# Altium schematic sheet WIZ850io_SCH_V100.SchDoc (part 1 of 3)
size A4; PageSetup: Record=PageOptions|CenterHorizontal=True|CenterVertical=True|PrintScale=0.97|XCorrection=1.00|YCorrection=1.00|PrintKind=1|BorderSize=5000000|LeftOffset=0|BottomOffset=0|Orientation=2|PaperLength=1000|PaperWidth=1000|Scale=100|PaperSource=7|PrintQuality=-3|MediaType=1|DitherType=10|PrintScaleMode=1|PaperKind=A4|PaperIndex=9
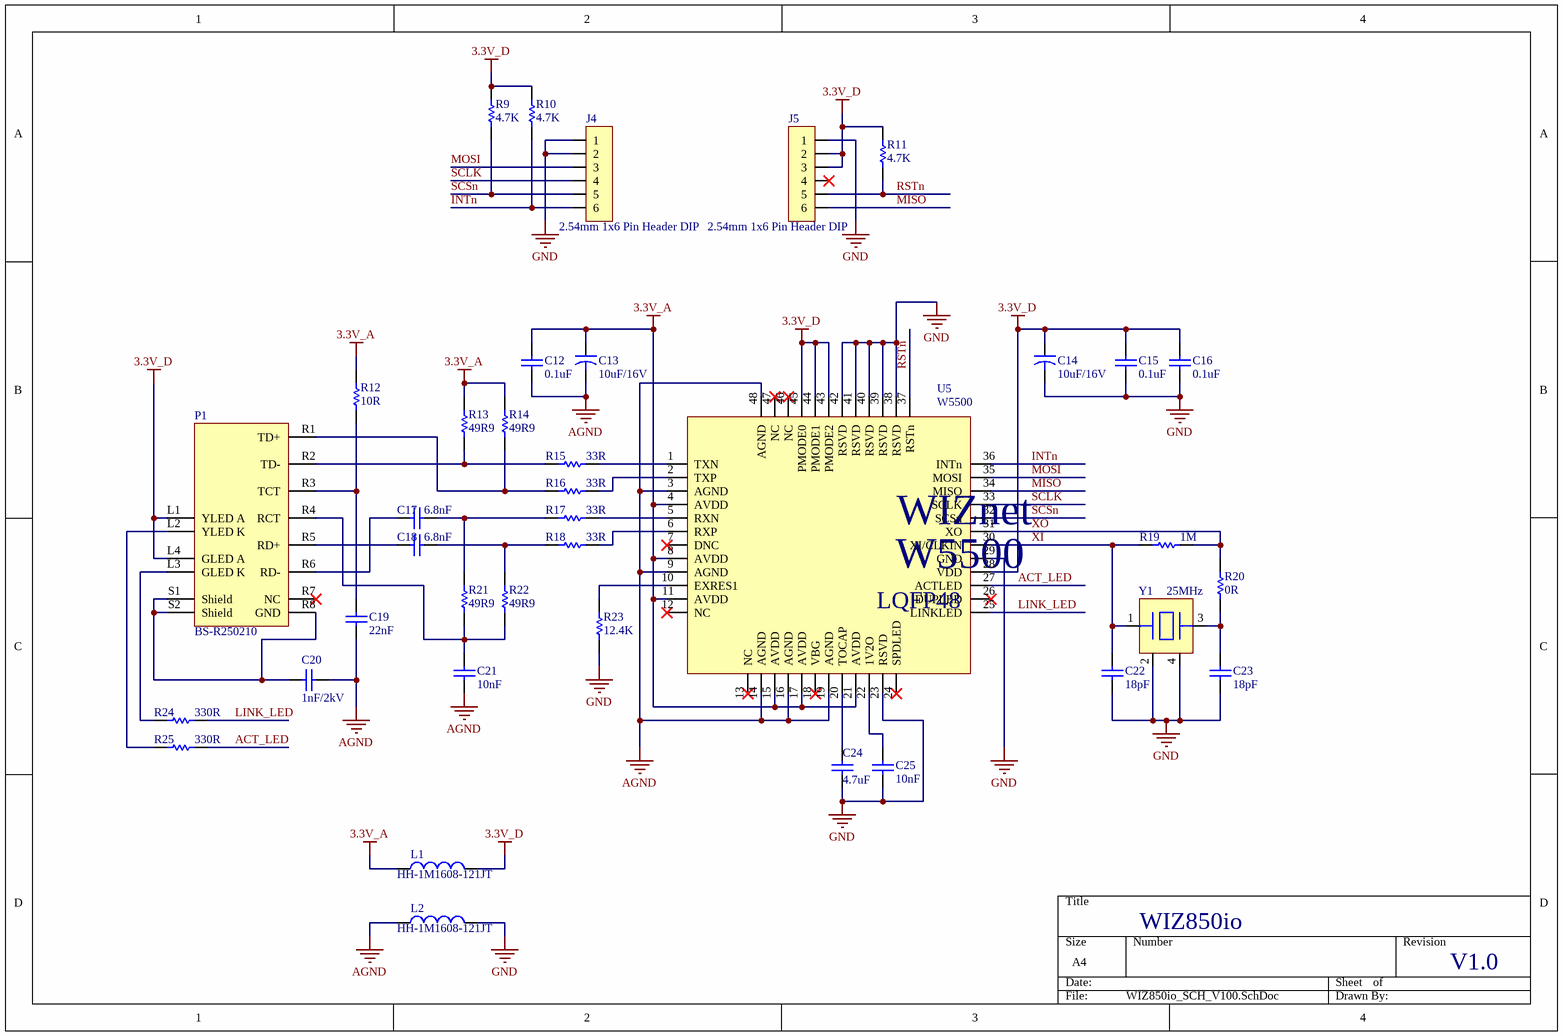
[diagram p0: WIZ850io_SCH_V100.SchDoc]

## Parts
C12  0.1uF  [*CAPC1608X90N]
C13  10uF/16V  [10uF 16V]
C14  10uF/16V  [10uF 16V]
C15  0.1uF  [*CAPC1608X90N]
C16  0.1uF  [*CAPC1608X90N]
C17  6.8nF  [6.8nF]
C18  6.8nF  [6.8nF]
C19  22nF  [22nF]
C20  1nF/2kV  [1nF/2kV]
C21  10nF  [10nF]
C22  18pF  [18pF]
C23  18pF  [18pF]
C24  4.7uF  [4.7 uF]
C25  10nF  [10nF]
J4  2.54mm 1x6 Pin Header DIP  [IDC-1X6]
J5  2.54mm 1x6 Pin Header DIP  [IDC-1X6]
L1  HH-1M1608-121JT  [IND-0603]
L2  HH-1M1608-121JT  [IND-0603]
P1  BS-R250210  [BS-R250210]
R9  4.7K  [4.7k OHM R]
R10  4.7K  [4.7k OHM R]
R11  4.7K  [4.7k OHM R]
R12  10R  [10OHM R]
R13  49R9  [49R9 OHM]
R14  49R9  [49R9 OHM]
R15  33R  [33OHM R]
R16  33R  [33OHM R]
R17  33R  [33OHM R]
R18  33R  [33OHM R]
R19  1M  [1M OHM R]
R20  0R  [0 OHM R]
R21  49R9  [49R9 OHM]
R22  49R9  [49R9 OHM]
R23  12.4K  [12.4k OHM R]
R24  330R  [ahhhh]
R25  330R  [ahhhh]
U5  W5500  [WIZnet W5500]
Y1  25MHz  [OSC-82J0626]

## Nets
3.3V_A: C12.2 C13.1 L1.1 R12.2 R13.2 R14.2 U5.4(AVDD) U5.8(AVDD) U5.11(AVDD) U5.15(AVDD) U5.17(AVDD) U5.21(AVDD)
3.3V_D: C14.1 C15.2 C16.2 J5.2 J5.3 L1.2 P1.L1(YLED_A) P1.L4(GLED_A) R9.2 R10.2 R11.2 U5.28(VDD) U5.43(PMODE2) U5.44(PMODE1) U5.45(PMODE0)
AGND: C12.1 C13.2 C19.1 C20.1 C21.1 L2.1 U5.3(AGND) U5.9(AGND) U5.14(AGND) U5.16(AGND) U5.19(AGND) U5.48(AGND)
GND: C14.2 C15.1 C16.1 C22.1 C23.1 C24.1 C25.1 J4.1 J4.2 J5.1 L2.2 R23.1 U5.23(RSVD) U5.29(GND) U5.38(RSVD) U5.39(RSVD) U5.40(RSVD) U5.41(RSVD) U5.42(RSVD) Y1.2 Y1.4
ACT_LED: R25.2 U5.27(ACTLED)
INTn: J4.6 R10.1 U5.36(INTn)
LINK_LED: R24.2 U5.25(LINKLED)
MISO: J5.6 U5.34(MISO)
MOSI: J4.3 U5.35(MOSI)
RSTn: J5.5 R11.1 U5.37(RSTn)
SCLK: J4.4 U5.33(SCLK)
SCSn: J4.5 R9.1 U5.32(SCSn)
XI: C22.2 R19.1 U5.30(XI/CLKIN) Y1.1
XO: R19.2 R20.2 U5.31(XO)
NetC17_1: C17.1 P1.R6(RD-)
NetC17_2: C17.2 R17.1 R21.2
NetC18_1: C18.1 P1.R5(RD+)
NetC18_2: C18.2 R18.1 R22.2
NetC19_2: C19.2 P1.R3(TCT) R12.1
NetC20_2: C20.2 P1.R8(GND) P1.S1(Shield) P1.S2(Shield)
NetC21_2: C21.2 P1.R4(RCT) R21.1 R22.1
NetC23_2: C23.2 R20.1 Y1.3
NetC24_2: C24.2 U5.20(TOCAP)
NetC25_2: C25.2 U5.22(1V2O)
NetP1_L2: P1.L2(YLED_K) R25.1
NetP1_L3: P1.L3(GLED_K) R24.1
NetP1_R1: P1.R1(TD+) R14.1 R16.1
NetP1_R2: P1.R2(TD-) R13.1 R15.1
NetR15_2: R15.2 U5.1(TXN)
NetR16_2: R16.2 U5.2(TXP)
NetR17_2: R17.2 U5.5(RXN)
NetR18_2: R18.2 U5.6(RXP)
NetR23_2: R23.2 U5.10(EXRES1)

Not connected (* = marked no-connect by the designer): J5 4*; P1 R7(NC)*; U5 7(DNC)* 12(NC)* 13(NC)* 18(VBG)* 24(SPDLED)* 26(DUPLED)* 46(NC)* 47(NC)*

## Notes on the sheet
- WIZ850io
- V1.0
- (in symbol W5500) LQFP48